# Altium schematic sheet Voltage Translator.SchDoc: Voltage Translator
size 393 x 292 mm; SheetNumber: 9; SheetTotal: 15
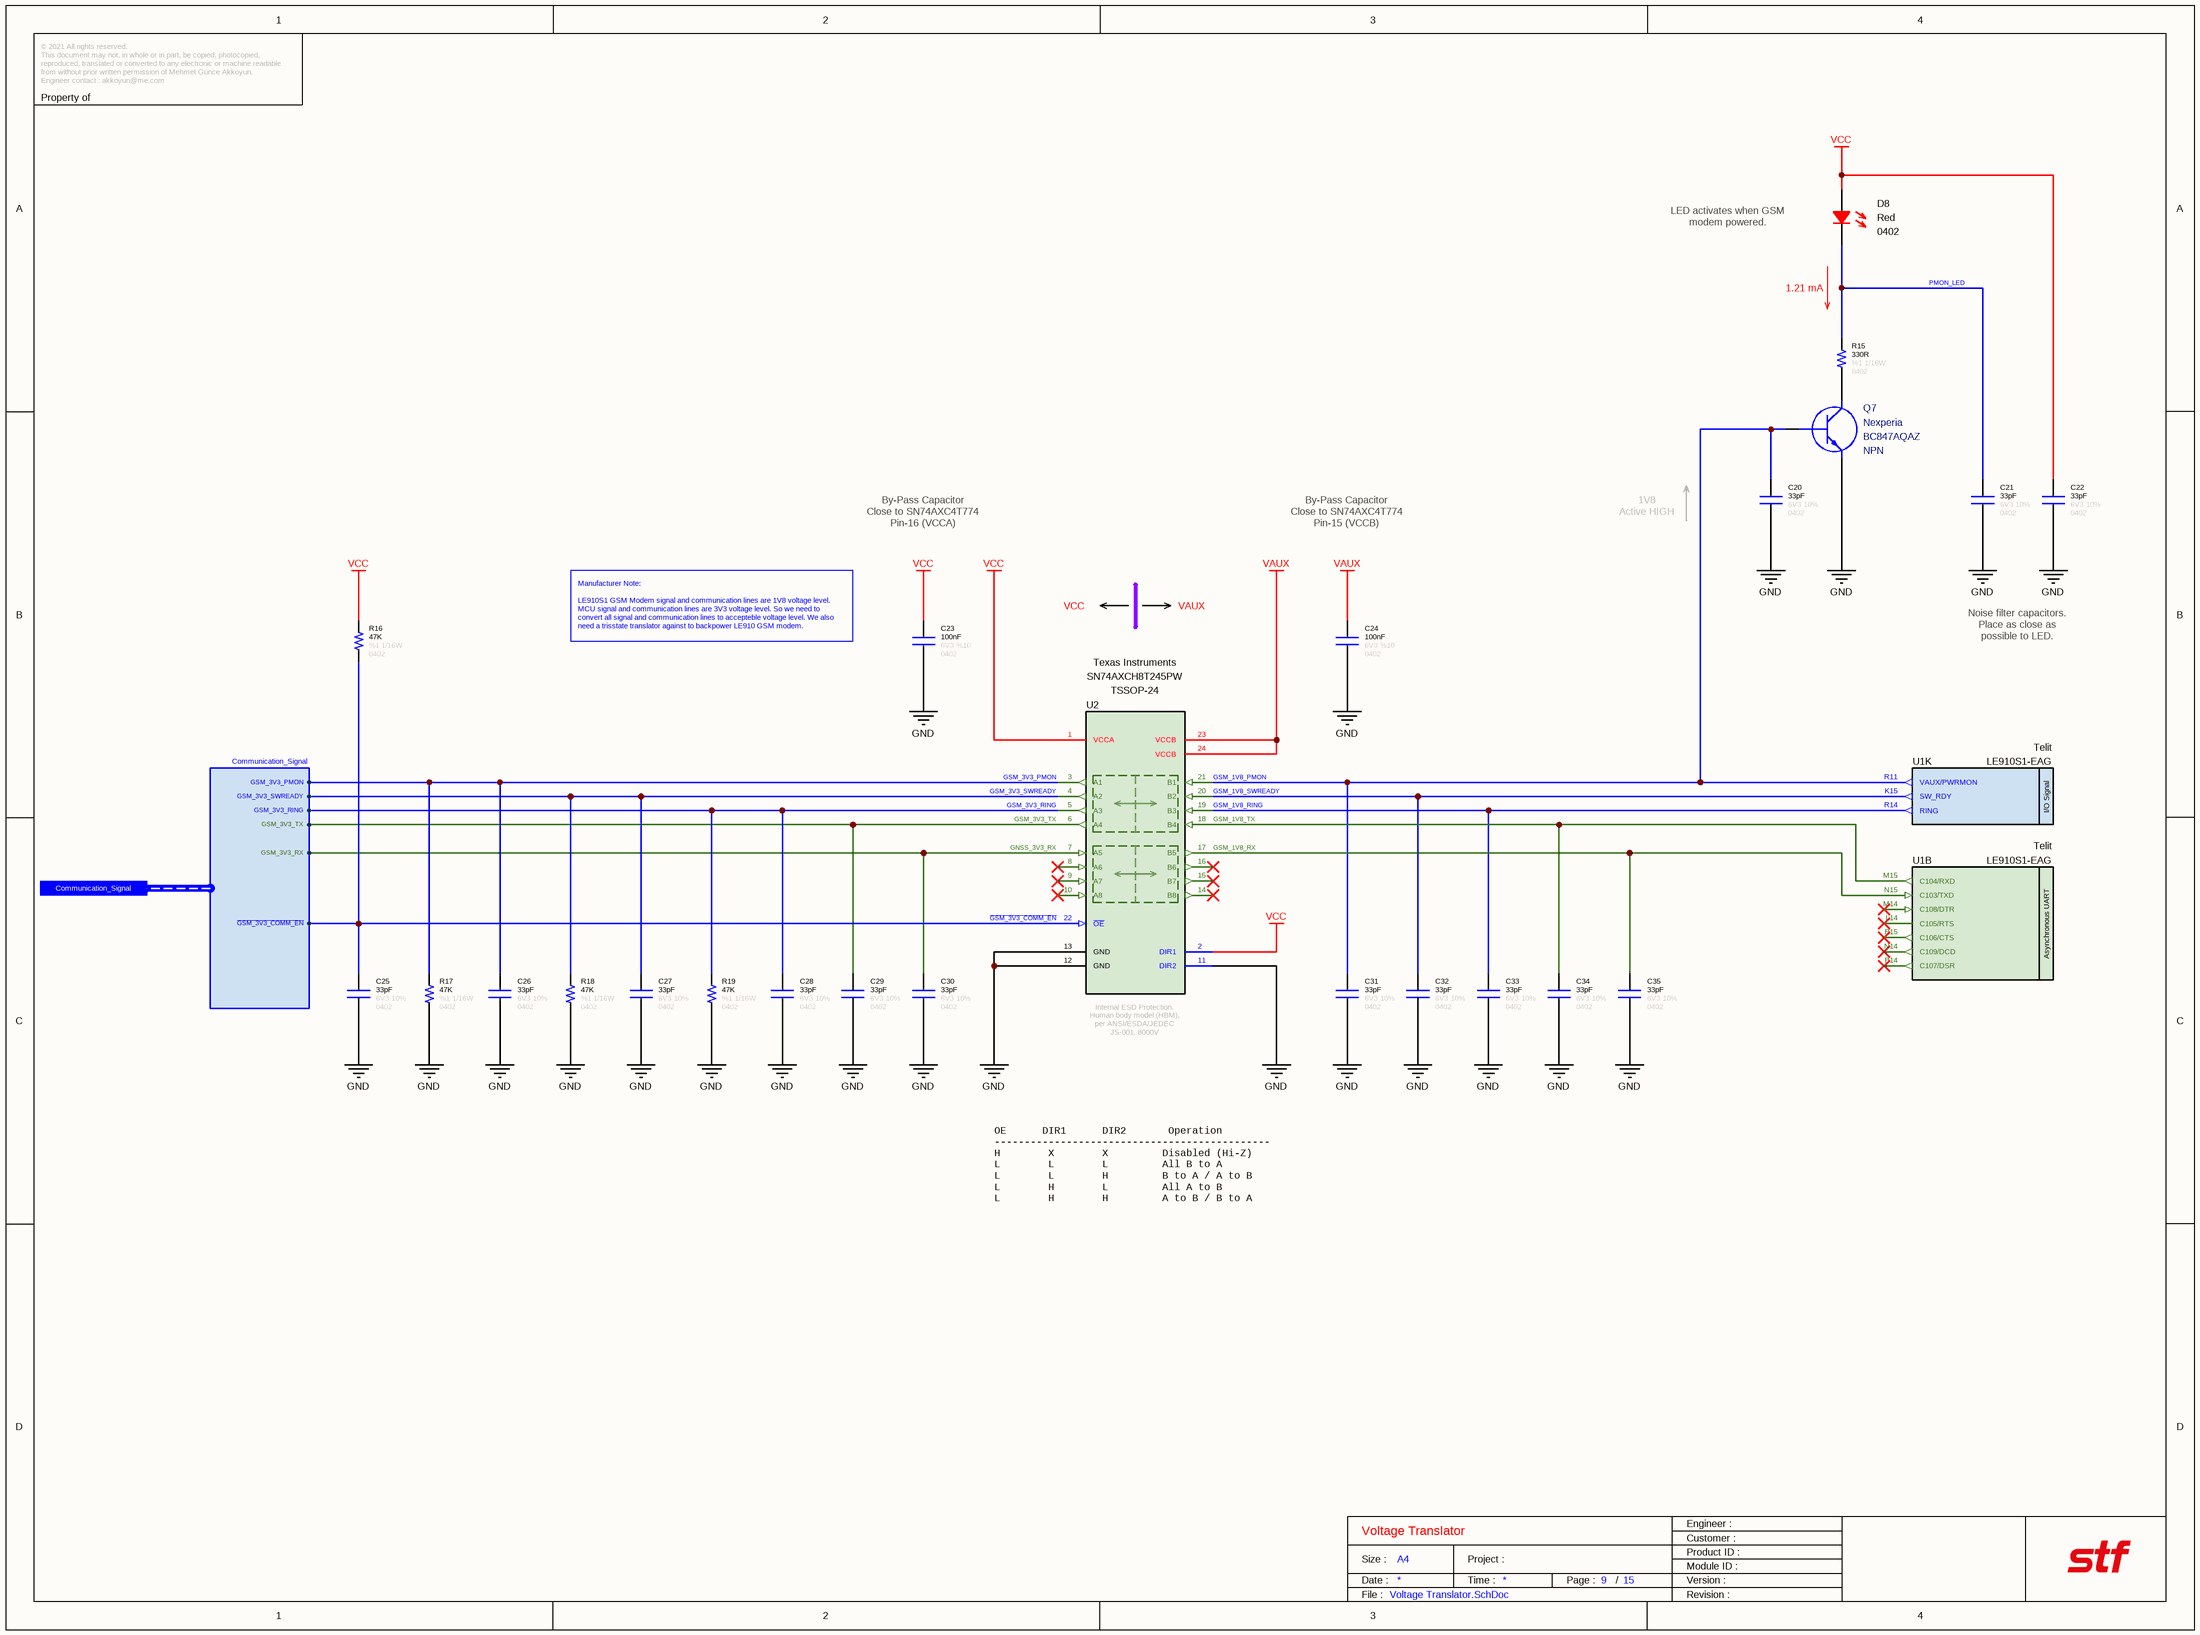
[diagram p0: Voltage Translator.SchDoc]

## Parts
C20  value 33pF  Tolerance: 10%  Case: 0402  Voltage: 6V3  [CAPACITOR_0402]  (hidden comment: Capacitor - 33pF [0402] (Ceramic))
C21  value 33pF  Tolerance: 10%  Case: 0402  Voltage: 6V3  [CAPACITOR_0402]  (hidden comment: Capacitor - 33pF [0402] (Ceramic))
C22  value 33pF  Tolerance: 10%  Case: 0402  Voltage: 6V3  [CAPACITOR_0402]  (hidden comment: Capacitor - 33pF [0402] (Ceramic))
C23  value 100nF  Tolerance: %10  Voltage: 6V3  Case: 0402  [CAPACITOR_0402]  (hidden comment: Capacitor - 100nF [0402] (Ceramic))
C24  value 100nF  Tolerance: %10  Voltage: 6V3  Case: 0402  [CAPACITOR_0402]  (hidden comment: Capacitor - 100nF [0402] (Ceramic))
C25  value 33pF  Tolerance: 10%  Case: 0402  Voltage: 6V3  [CAPACITOR_0402]  (hidden comment: Capacitor - 33pF [0402] (Ceramic))
C26  value 33pF  Tolerance: 10%  Case: 0402  Voltage: 6V3  [CAPACITOR_0402]  (hidden comment: Capacitor - 33pF [0402] (Ceramic))
C27  value 33pF  Tolerance: 10%  Case: 0402  Voltage: 6V3  [CAPACITOR_0402]  (hidden comment: Capacitor - 33pF [0402] (Ceramic))
C28  value 33pF  Tolerance: 10%  Case: 0402  Voltage: 6V3  [CAPACITOR_0402]  (hidden comment: Capacitor - 33pF [0402] (Ceramic))
C29  value 33pF  Tolerance: 10%  Case: 0402  Voltage: 6V3  [CAPACITOR_0402]  (hidden comment: Capacitor - 33pF [0402] (Ceramic))
C30  value 33pF  Tolerance: 10%  Case: 0402  Voltage: 6V3  [CAPACITOR_0402]  (hidden comment: Capacitor - 33pF [0402] (Ceramic))
C31  value 33pF  Tolerance: 10%  Case: 0402  Voltage: 6V3  [CAPACITOR_0402]  (hidden comment: Capacitor - 33pF [0402] (Ceramic))
C32  value 33pF  Tolerance: 10%  Case: 0402  Voltage: 6V3  [CAPACITOR_0402]  (hidden comment: Capacitor - 33pF [0402] (Ceramic))
C33  value 33pF  Tolerance: 10%  Case: 0402  Voltage: 6V3  [CAPACITOR_0402]  (hidden comment: Capacitor - 33pF [0402] (Ceramic))
C34  value 33pF  Tolerance: 10%  Case: 0402  Voltage: 6V3  [CAPACITOR_0402]  (hidden comment: Capacitor - 33pF [0402] (Ceramic))
C35  value 33pF  Tolerance: 10%  Case: 0402  Voltage: 6V3  [CAPACITOR_0402]  (hidden comment: Capacitor - 33pF [0402] (Ceramic))
D8  Case: 0402  Color: Red  [LED_0402]  (hidden comment: SMD LED (Red))
Q7  Manufacturer Name: Nexperia  Polarity: NPN  [SOT1215]  (hidden comment: BC847AQAZ)
R15  value 330R  Case: 0402  Tolerance: %1  Power: 1/16W  [RESISTOR_0402]  (hidden comment: 330R - 0402 - %1 - 1/16W)
R16  value 47K  Tolerance: %1  Case: 0402  Power: 1/16W  [RESISTOR_0402]  (hidden comment: 47K - 0402 - %1 - 1/16W)
R17  value 47K  Tolerance: %1  Case: 0402  Power: 1/16W  [RESISTOR_0402]  (hidden comment: 47K - 0402 - %1 - 1/16W)
R18  value 47K  Tolerance: %1  Case: 0402  Power: 1/16W  [RESISTOR_0402]  (hidden comment: 47K - 0402 - %1 - 1/16W)
R19  value 47K  Tolerance: %1  Case: 0402  Power: 1/16W  [RESISTOR_0402]  (hidden comment: 47K - 0402 - %1 - 1/16W)
U1  Manufacturer Part Number: LE910S1-EAG  Manufacturer Name: Telit  [LE910 GSM Modem]  (hidden comment: LE910S1-EAG LTE GSM Module)  (parts B,K of 19)
U2  Manufacturer Name: Texas Instruments  [TSSOP-24]  (hidden comment: SN74AXCH8T245PW)

## Ports
Communication_Signal (harness Communication_Signal)

## Harnesses
Communication_Signal: GSM_3V3_PMON, GSM_3V3_SWREADY, GSM_3V3_RING, ~{GSM_3V3_COMM_EN}, GSM_3V3_TX, GSM_3V3_RX

## Nets
GND: C20.1 C21.1 C22.1 C23.1 C24.1 C25.1 C26.1 C27.1 C28.1 C29.1 C30.1 C31.1 C32.1 C33.1 C34.1 C35.1 Q7.2(E) R17.1 R18.1 R19.1 U2.11(DIR2) U2.12(GND) U2.13(GND)
VAUX: C24.2 U2.23(VCCB) U2.24(VCCB)
VCC: C22.2 C23.2 D8.2 R16.2 U2.1(VCCA) U2.2(DIR1)
~{GSM_3V3_COMM_EN}: C25.2 R16.1 U2.22(~{OE}) ; port Communication_Signal.~{GSM_3V3_COMM_EN}
GNSS_3V3_RX: C30.2 U2.7(A5) ; port Communication_Signal.GSM_3V3_RX
GSM_1V8_PMON: C20.2 C31.2 Q7.1(B) U1.R11(VAUX/PWRMON) U2.21(B1)
GSM_1V8_RING: C33.2 U1.R14(RING) U2.19(B3)
GSM_1V8_RX: C35.2 U1.N15(C103/TXD) U2.17(B5)
GSM_1V8_SWREADY: C32.2 U1.K15(SW_RDY) U2.20(B2)
GSM_1V8_TX: C34.2 U1.M15(C104/RXD) U2.18(B4)
GSM_3V3_PMON: C26.2 R17.2 U2.3(A1) ; port Communication_Signal.GSM_3V3_PMON
GSM_3V3_RING: C28.2 R19.2 U2.5(A3) ; port Communication_Signal.GSM_3V3_RING
GSM_3V3_SWREADY: C27.2 R18.2 U2.4(A2) ; port Communication_Signal.GSM_3V3_SWREADY
GSM_3V3_TX: C29.2 U2.6(A4) ; port Communication_Signal.GSM_3V3_TX
PMON_LED: C21.2 D8.1 R15.2
NetQ7_3: Q7.3(C) R15.1

Not connected (* = marked no-connect by the designer): U1 L14(C105/RTS)* M14(C108/DTR)* N14(C109/DCD)* P14(C107/DSR)* P15(C106/CTS)*; U2 8(A6)* 9(A7)* 10(A8)* 14(B8)* 15(B7)* 16(B6)*

## Notes on the sheet
- (near D8) LED activates when GSM modem powered.
- 1.21 mA
- 1V8
  Active HIGH
- By-Pass Capacitor
  Close to SN74AXC4T774
  Pin-16 (VCCA)
- By-Pass Capacitor
  Close to SN74AXC4T774
  Pin-15 (VCCB)
- Manufacturer Note:
  LE910S1 GSM Modem signal and communication lines are 1V8 voltage level.  MCU signal and communication lines are 3V3 voltage level. So we need to convert all signal and communication lines to accepteble voltage level. We also need a trisstate translator against to backpower LE910 GSM modem.
- VCC
- VAUX
- Noise filter capacitors. Place as close as possible to LED.
- OE      DIR1      DIR2       Operation
  ----------------------------------------------
  H        X        X         Disabled (Hi-Z)
  L        L        L         All B to A
  L        L        H         B to A / A to B
  L        H        L         All A to B
  L        H        H         A to B / B to A
- © 2021 All rights reserved.
  This document may not, in whole or in part, be copied, photocopied, reproduced, translated or converted to any electronic or machine readable from without prior written permission of Mehmet Günce Akkoyun.
  Engineer contact : akkoyun@me.com
- Property of
- Engineer :
- Date :
- Size :
- A4
- Time :
- Project :
- Page :
- /
- Customer :
- Product ID :
- Module ID :
- Version :
- File :
- Revision :
- (in symbol IC - LE910S1-EAG, part B) Asynchronous UART
- (in symbol IC - LE910S1-EAG, part K) I/O Signal
- (in symbol IC - SN74AXCH8T245PW) Internal ESD Protection. / Human body model (HBM), per ANSI/ESDA/JEDEC JS-001. 8000V

## Library data of the parts
C20-C22 C25-C35 = Capacitor - 33pF [0402-6V3]: Manufacturer Name: Kemet; Manufacturer Part Number: C0402C330J9RACAUTO; ComponentLink1Description: DataSheet; ComponentLink1URL: https://api.kemet.com/component-edge/download/datasheet/C0402C330J9RACAUTO.pdf; ComponentLink2Description: Mouser; ComponentLink2URL: https://www.mouser.com/Search/Refine.aspx?Keyword=80-C0402C330J9RAUTO
C23 C24 = Capacitor - 100nF [0402-6V3]: Capacitor - 100nF [0402-6V3] (Ceramic); Manufacturer Name: AVX; Manufacturer Part Number: 04026D104KAT4A; ComponentLink1Description: Mouser; ComponentLink1URL: https://www.mouser.com.tr/ProductDetail/AVX/04026D104KAT4A?qs=sGAEpiMZZMs0AnBnWHyRQPg4iYkCw7IMED%2F4kpqgf7w%3D; ComponentLink2Description: DataSheet; ComponentLink2URL: https://www.mouser.com.tr/datasheet/2/40/cx5r-776519.pdf
D8 = Diode - LED (0402-Red): Standard LEDs - SMD MINI-MOLD ULTRA COMPACT RED; Manufacturer Name: ROHM Semiconductor; Manufacturer Part Number: SML-P12VTT86R; ROHS: Yes; ComponentLink1Description: DataSheet; ComponentLink1URL: https://www.mouser.com.tr/datasheet/2/348/sml-p1-e-1139198.pdf; ComponentLink2Description: Mouser; ComponentLink2URL: https://www.mouser.com.tr/ProductDetail/ROHM-Semiconductor/SML-P12U2TT86R?qs=sGAEpiMZZMseGfSY3csMkRIBDsfU3UCXJTULB5gem9Ta%252Bp%252BvZ709fg%3D%3D
Q7 = Transistor - BC847: Bipolar NPN Transistors; Case: DFN-1010D-3; Manufacturer Part Number: BC847AQAZ
R15 = Resistor - 330R [0402]: Thick Film Resistors - SMD 1/16 W 330 Ohm 1%; Manufacturer Name: Vishay; Manufacturer Part Number: CRCW0402330RFKED; ComponentLink1Description: DataSheet; ComponentLink1URL: https://www.mouser.com.tr/datasheet/2/427/dcrcwe3-1762152.pdf; ComponentLink2Description: Mouser; ComponentLink2URL: https://www.mouser.com.tr/ProductDetail/Vishay-Dale/CRCW0402330RFKED?qs=sGAEpiMZZMu61qfTUdNhG2DpbjADlD3GGS6SwBlLi5Q%3D
R16-R19 = Resistor - 47K [0402]: Thick Film Resistors - SMD 1/16 W 47 KOhm 1%; Manufacturer Name: Vishay; Manufacturer Part Number: CRCW040247K0FKED; ComponentLink1Description: DataSheet; ComponentLink1URL: https://www.mouser.com.tr/datasheet/2/427/dcrcwe3-1762152.pdf; ComponentLink2Description: Mouser; ComponentLink2URL: https://www.mouser.com.tr/ProductDetail/Vishay-Dale/CRCW040247K0FKED?qs=sGAEpiMZZMu61qfTUdNhG2DpbjADlD3GL%252B3h1elTxqU%3D
U1 = IC - LE910S1-EAG: Telit LE910S1-EAG GPRS/GNSS Module; Case: BGA
U2 = IC - SN74AXCH8T245PW: Translation - Voltage Levels 8-Bit Dual-Supply Bus Transceiver 24-TSSOP -40 to 125; Number of Channels: 8 Channel; Logic Family: AXC; Data Rate: 380Mbps; Channel Type: Bidirectional; Supply Voltage - Min: 0V65; Supply Voltage - Max: 3V6; Output Type: Tri-State, Non-Inverted; Operating Supply Current: 60 uA; Propagation Delay Time: 4 ns; ROHS: Yes; Minimum Operating Temperature: - 40 C; Product Type: Translation - Voltage Levels; Maximum Operating Temperature: + 125 C; Manufacturer Part Number: SN74AXCH8T245PW; Case: TSSOP-24